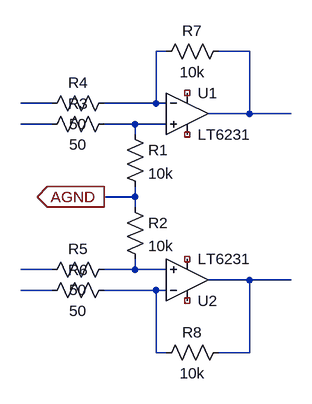
[diagram p0: schematic Differencial summing amplifier.asc]
Differencial summing amplifier.asc, the LTspice schematic file:
Version 4
SHEET 1 880 680
WIRE 480 128 464 128
WIRE 608 128 560 128
WIRE 304 208 256 208
WIRE 464 208 464 128
WIRE 464 208 384 208
WIRE 480 208 464 208
WIRE 608 224 608 128
WIRE 608 224 544 224
WIRE 672 224 608 224
WIRE 304 240 256 240
WIRE 432 240 384 240
WIRE 480 240 432 240
WIRE 432 256 432 240
WIRE 432 352 432 336
WIRE 432 352 384 352
WIRE 432 368 432 352
WIRE 304 464 256 464
WIRE 432 464 432 448
WIRE 432 464 384 464
WIRE 480 464 432 464
WIRE 608 480 544 480
WIRE 672 480 608 480
WIRE 304 496 256 496
WIRE 464 496 384 496
WIRE 480 496 464 496
WIRE 464 592 464 496
WIRE 480 592 464 592
WIRE 608 592 608 480
WIRE 608 592 560 592
FLAG 384 352 AGND
IOPIN 384 352 Out
SYMBOL Opamps/LT6231 512 224 R0
SYMATTR InstName U1
SYMBOL Opamps/LT6231 512 480 M180
SYMATTR InstName U2
SYMBOL res 416 240 R0
SYMATTR InstName R1
SYMATTR Value 10k
SYMBOL res 416 352 R0
SYMATTR InstName R2
SYMATTR Value 10k
SYMBOL res 400 224 R90
WINDOW 0 0 56 VBottom 2
WINDOW 3 32 56 VTop 2
SYMATTR InstName R3
SYMATTR Value 50
SYMBOL res 400 192 R90
WINDOW 0 0 56 VBottom 2
WINDOW 3 32 56 VTop 2
SYMATTR InstName R4
SYMATTR Value 50
SYMBOL res 400 448 R90
WINDOW 0 0 56 VBottom 2
WINDOW 3 32 56 VTop 2
SYMATTR InstName R5
SYMATTR Value 50
SYMBOL res 400 480 R90
WINDOW 0 0 56 VBottom 2
WINDOW 3 32 56 VTop 2
SYMATTR InstName R6
SYMATTR Value 50
SYMBOL res 576 112 R90
WINDOW 0 0 56 VBottom 2
WINDOW 3 32 56 VTop 2
SYMATTR InstName R7
SYMATTR Value 10k
SYMBOL res 576 576 R90
WINDOW 0 0 56 VBottom 2
WINDOW 3 32 56 VTop 2
SYMATTR InstName R8
SYMATTR Value 10k

The netlist it stands for:
* Differencial summing amplifier.asc
XU1 N005 N001 N002 NC_01 NC_02 LT6231  ; pins In+ In- OUT V+ V-
XU2 N007 N010 N008 NC_03 NC_04 LT6231  ; pins In+ In- OUT V+ V-
R1 N005 AGND 10k
R2 AGND N007 10k
R3 N005 N004 50
R4 N001 N003 50
R5 N007 N006 50
R6 N010 N009 50
R7 N002 N001 10k
R8 N008 N010 10k
.lib LTC2.lib
.backanno
.end